# Altium project Ultrasound.PrjPCB
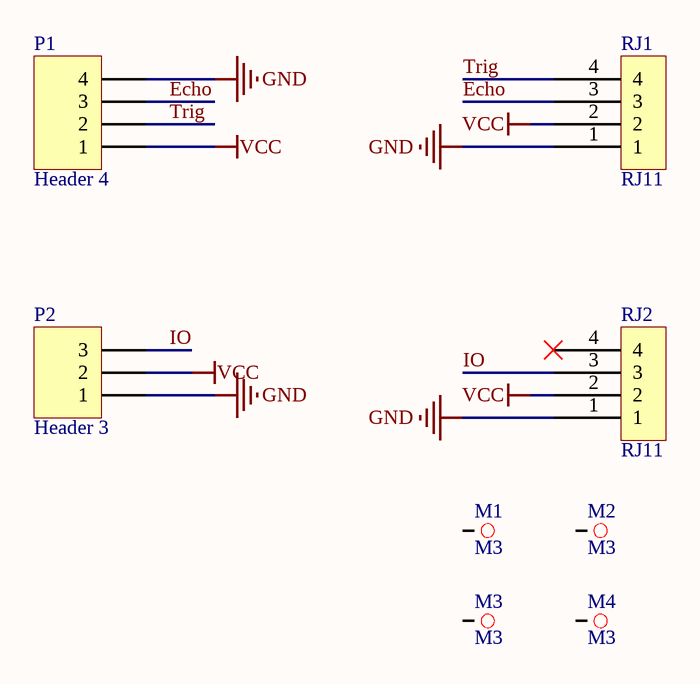
[diagram p0: Ultrasound.SchDoc]
1 sheet, 8 parts. Net scope: global (net labels, ports and power ports of the same name join across sheets).
Board file: Ultrasound.PcbDoc

## Sheet Ultrasound.SchDoc
size A4

### Parts
M1  M3  [M3]
M2  M3  [M3]
M3  M3  [M3]
M4  M3  [M3]
P1  Header 4  [HDR1X4]
P2  Header 3  [HDR1X3]
RJ1  RJ11  [RJ11]
RJ2  RJ11  [RJ11]

### Nets
GND: P1.4 P2.1 RJ1.1 RJ2.1
VCC: P1.1 P2.2 RJ1.2 RJ2.2
Echo: P1.3 RJ1.3
IO: P2.3 RJ2.3
Trig: P1.2 RJ1.4

Not connected (* = marked no-connect by the designer): M1 0; M2 0; M3 0; M4 0; RJ2 4*

### Library data of the parts
P1 = Header 4: Header, 4-Pin; LatestRevisionDate: 17-Jul-2002; LatestRevisionNote: Re-released for DXP Platform.; Publisher: Altium Limited
P2 = Header 3: Header, 3-Pin; LatestRevisionDate: 17-Jul-2002; LatestRevisionNote: Re-released for DXP Platform.; Publisher: Altium Limited